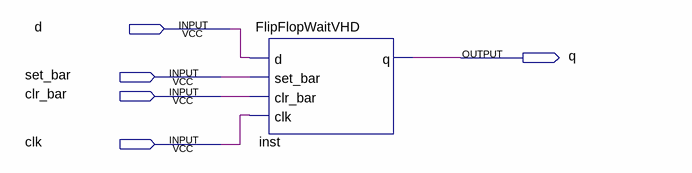
[diagram p0: schematic sheet]
// Quartus schematic FlipFlopWait.bdf as structural Verilog: 1 symbols, 5 pins
module FlipFlopWait (
  input  d,
  input  set_bar,
  input  clr_bar,
  input  clk,
  output q
);

  FlipFlopWaitVHD inst (.d(d), .set_bar(set_bar), .clr_bar(clr_bar), .clk(clk), .q(q));
endmodule
